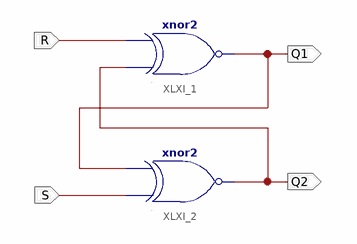
[diagram p0: schematic sheet 1]
// Xilinx ISE schematic Lab7Exp3.sch (spartan3e) as structural Verilog: 2 symbols, 4 ports
module Lab7Exp3 (
  input  R,
  input  S,
  output Q2,
  output Q1
);

  xnor XLXI_1 (Q1, Q2, R);
  xnor XLXI_2 (Q2, S, Q1);
endmodule
